# Altium schematic sheet Stepper_DRV8825_Interface.SchDoc
size A4; CompanyName: Technische Hochschule Nürnberg Georg Simon Ohm; Organization: UltraZohm; Address1: Kesslerplatz 12; Address2: 90489 Nürnberg; Address3: GERMANY; Website: www.ultrazohm.com
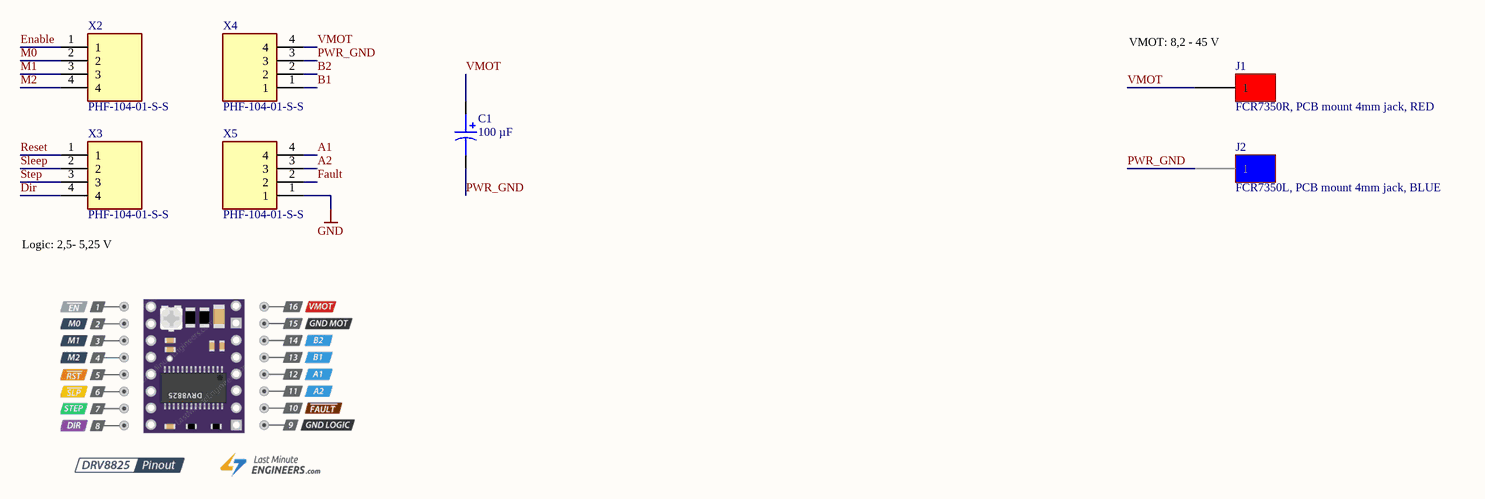
[diagram p0: Stepper_DRV8825_Interface.SchDoc]

## Parts
C1  100 µF  [CAPAE830X1050N]
J1  FCR7350R, PCB mount 4mm jack, RED  [FCR7350]
J2  FCR7350L, PCB mount 4mm jack, BLUE  [FCR7350]
X2  PHF-104-01-S-S  [PHF-104-01-S-S]
X3  PHF-104-01-S-S  [PHF-104-01-S-S]
X4  PHF-104-01-S-S  [PHF-104-01-S-S]
X5  PHF-104-01-S-S  [PHF-104-01-S-S]

## Nets
GND: X5.1
A1: X5.4
A2: X5.3
B1: X4.1
B2: X4.2
Dir: X3.4
Enable: X2.1
Fault: X5.2
M0: X2.2
M1: X2.3
M2: X2.4
PWR_GND: C1.2 J2.1 X4.3
Reset: X3.1
Sleep: X3.2
Step: X3.3
VMOT: C1.1 J1.1 X4.4

## Notes on the sheet
- (near J1) VMOT: 8,2 - 45 V
- (near X3) Logic: 2,5- 5,25 V
- Title
- Revision:
- Design Engineer:
- Date:
- Project:
- Sheet
- of

## Library data of the parts
C1 = EEE-FK1H101P: Capacitor EEE, 50 VDC, 100 µF; Manufacturer: Panasonic; Tolerance: 20 %; Voltage Rating: 50 VDC; Created from: MGremer; Manufacturer Part Number: EEE-FK1H101P; PartID: 61; Created On: 20.12.2020 13:54:13; ComponentLink1Description: Datasheet; ComponentLink1URL: https://www.mouser.de/datasheet/2/315/ABA0000C1181-947564.pdf; Component Type: Capacitor EEE; Device Package: EEE; Last Updated: 18.01.2021 16:16:48; Mounting Type: SMD; Operating Temperature: -55 - 105°C; Series: FK-V; Supplier 1: Mouser; Supplier Part Number 1: 667-EEE-FK1H101P; Type: Capacitor; Value: 100 µF; Live Cycle Status: 1; Stock number: not stored
J1 = FCR7350R: FCR7350B, 1000V, 24A, RED; Manufacturer: Cliff; Value: PCB mount 4mm jack, Red FCR7350R, 1000V, 24A; Created from: DHufnagel; Manufacturer Part Number: FCR7350R; PartID: 7; Created On: 13.06.2022 10:18:11; ComponentLink1Description: datasheet; ComponentLink1URL: https://www.cliffuk.co.uk/products/testleads/sockets/S16NPC.pdf; ComponentLink2Description: drawing; ComponentLink2URL: https://media.digikey.com/pdf/Data%20Sheets/Cliff%20Electronic%20LTD%20PDF's/FCR7350_Drawing.pdf; Component Type: PCB mount 4mm jack, Red; Device Package: THT; Last Updated: 28.06.2022 13:58:37; Minimum Order: 1; Mounting Type: THT; Operating Temperature: -40°C - 80°C; Series: S16N-PC; Supplier 1: Digi-Key; Supplier Part Number 1: 3185-FCR7350R-ND; Supplier 2: farnell; Supplier Part Number 2: 1854508; Type: PCB mount 4mm jack, Red FCR7350R, 1000V, 24A; Live Cycle Status: 1; Stock number: not stored
J2 = FCR7350L: FCR7350B, 1000V, 24A, BLUE; Manufacturer: Cliff; Value: PCB mount 4mm jack, Blue FCR7350L, 1000V, 24A; Created from: DHufnagel; Manufacturer Part Number: FCR7350L; PartID: 8; Created On: 13.06.2022 10:18:11; ComponentLink1Description: datasheet; ComponentLink1URL: https://www.cliffuk.co.uk/products/testleads/sockets/S16NPC.pdf; ComponentLink2Description: drawing; ComponentLink2URL: https://media.digikey.com/pdf/Data%20Sheets/Cliff%20Electronic%20LTD%20PDF's/FCR7350_Drawing.pdf; Component Type: PCB mount 4mm jack, Blue; Device Package: THT; Last Updated: 28.06.2022 13:58:37; Minimum Order: 1; Mounting Type: THT; Operating Temperature: -40°C - 80°C; Series: S16N-PC; Supplier 1: Digi-Key; Supplier Part Number 1: 3185-FCR7350L-ND; Supplier 2: farnell; Supplier Part Number 2: 1854511; Type: PCB mount 4mm jack, Blue FCR7350L, 1000V, 24A; Live Cycle Status: 1; Stock number: not stored
X2-X5 = PHF-104-01-S-S: PIN Header; Manufacturer_Name: SAMTEC; Created from: MGremer; Number of positions: 4; Datasheet Link: https://www.mouser.com/datasheet/2/527/phf-1370209.pdf; Height: 8.5mm; Manufacturer_Part_Number: PHF-104-01-S-S; Mouser Part Number: 200-PHF10401SS; Mouser Price/Stock: https://www.mouser.com/Search/Refine.aspx?Keyword=200-PHF10401SS; Manufacturer Part Number: PHF-104-01-S-S; PartID: 10; Created On: 26.02.2021 16:36:12; ComponentLink1Description: Homepage; ComponentLink1URL: https://www.samtec.com/products/phf; Component Type: Board to Board Connector; Device Package: SMD; Last Updated: 27.09.2021 10:28:08; Manufacturer: SAMTEC; Mounting Type: SMD; Series: FTS; Supplier 1: SAMTEC; Supplier Part Number 1: PHF-104-01-S-S; Type: Board to Board Connector; Live Cycle Status: 1; Stock number: not stored; Number of rows: 1